# EasyEDA Pro project ProPrj_ABRGBDRV MK I_2025-07-25.epro

# Schematic Schematic1
Board Name: Board1; Create Date: 2025-07-16; Page Name: P1; Project Name: ABRGBDRV MK I; Schematic Name: Schematic1; Update Date: 2025-07-17; Company: 嘉立创EDA; Page Size: A4; Version: V1.0
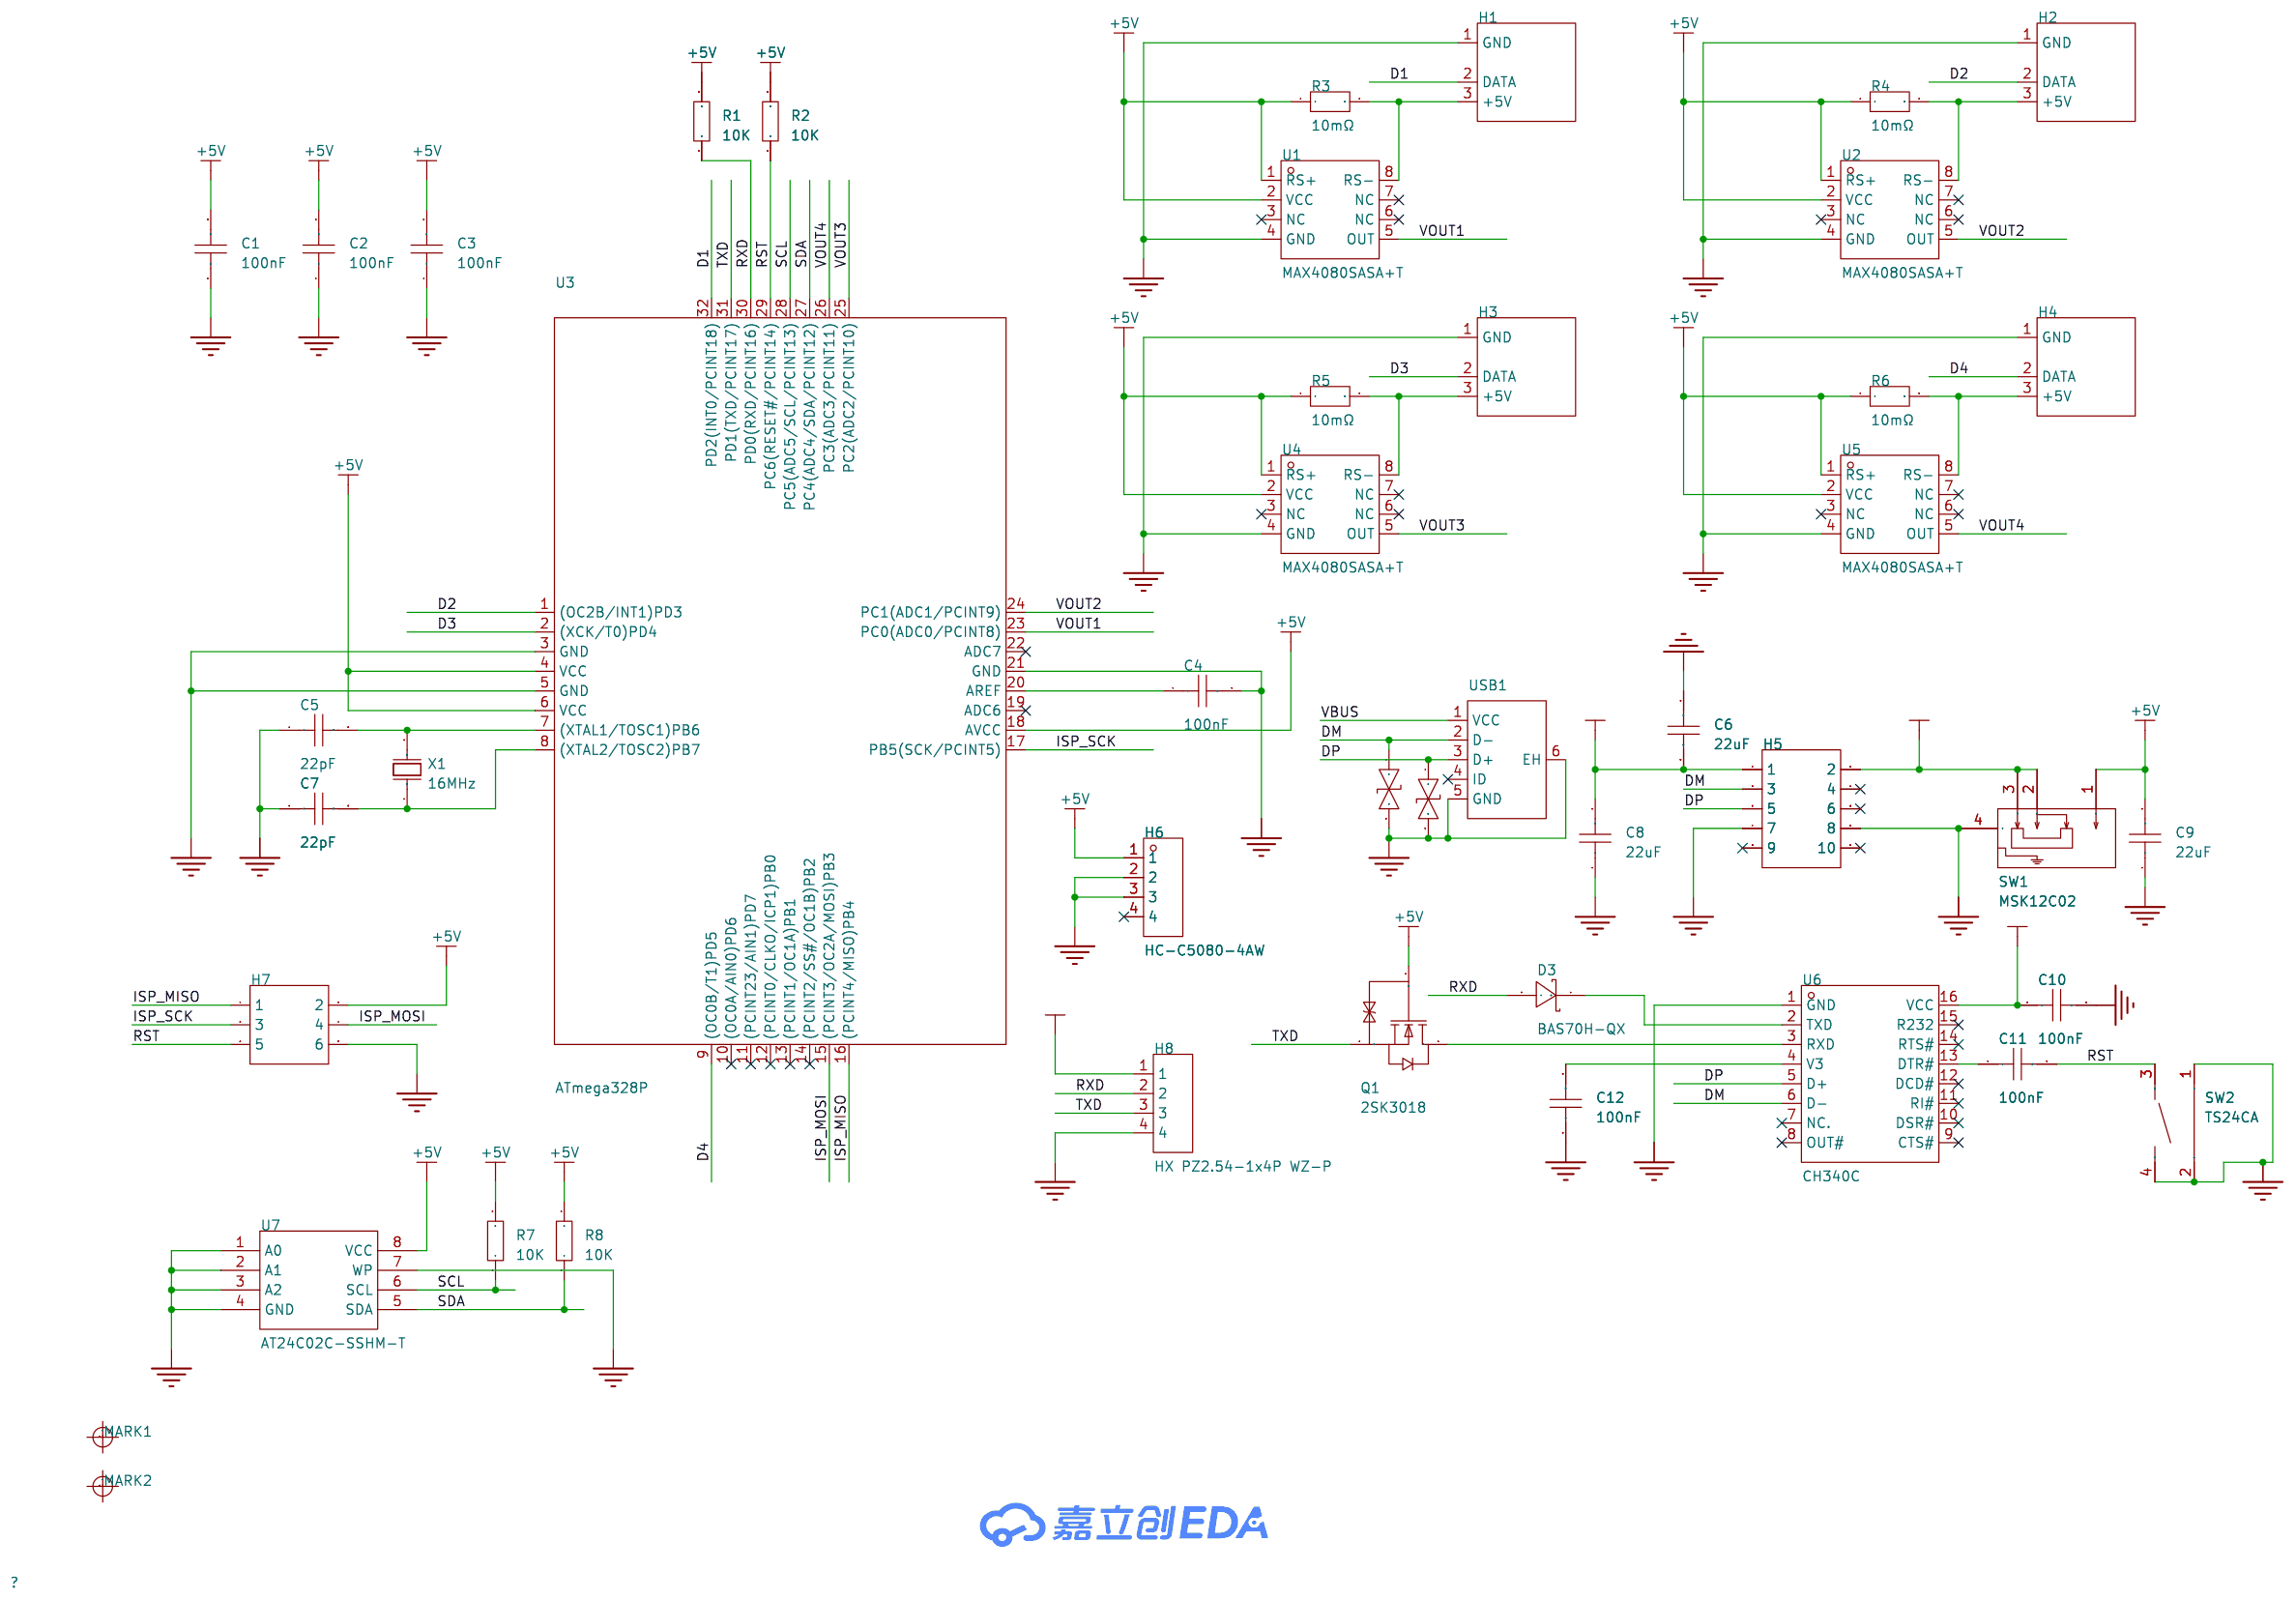
[diagram p0: schematic sheet]

## Parts
C1  100nF  [C0603]
C2  100nF  [C0603]
C3  100nF  [C0603]
C4  100nF  [C0603]
C5  22pF  [C0402]
C6  22uF  [C0805]
C7  22pF  [C0402]
C8  22uF  [C0805]
C9  22uF  [C0805]
C10  100nF  [C0603]
C11  100nF  [C0603]
C12  100nF  [C0603]
D1  0402ESDA-05N  [D0402]
D2  0402ESDA-05N  [D0402]
D3  BAS70H-QX  [SOD-123_L2.6-W1.6-LS3.5-RD]
H1  -  [ARGB TH_3P-P2.54 弯针]
H2  -  [ARGB TH_3P-P2.54 弯针]
H3  -  [ARGB TH_3P-P2.54 弯针]
H4  -  [ARGB TH_3P-P2.54 弯针]
H5  -  [HDR-TH_10P-P2.54-V-F-R2-C5-S2.54]
H6  HC-C5080-4AW  [CONN-TH_4P-P5.08_HCTL_HC-C5080-4AW]
H7  -  [HDR-TH_6P-P2.54-V-R2-C3-S2.54_A2541WV-2X3P]
H8  HX PZ2.54-1x4P WZ-P  [HDR-TH_4P-P2.54-H-M-W11.0]
MARK1  -  [Mark-Point-1mm]  (no BOM)
MARK2  -  [Mark-Point-1mm]  (no BOM)
Q1  2SK3018  [SOT-23-3_L2.9-W1.4-P1.90-LS2.6-BR]
R1  10K  [R0402]
R2  10K  [R0402]
R3  10mΩ  [R2512]
R4  10mΩ  [R2512]
R5  10mΩ  [R2512]
R6  10mΩ  [R2512]
R7  10K  [R0402]
R8  10K  [R0402]
SW1  MSK12C02  [SW-TH_MSK12C02]
SW2  TS24CA  [SW-SMD_TS24CA]
U1  MAX4080SASA+T  [SOP-8_L4.9-W3.9-P1.27-LS6.0-BL]
U2  MAX4080SASA+T  [SOP-8_L4.9-W3.9-P1.27-LS6.0-BL]
U3  ATmega328P  [LQFP-32_L7.0-W7.0-P0.80-LS9.0-TL]
U4  MAX4080SASA+T  [SOP-8_L4.9-W3.9-P1.27-LS6.0-BL]
U5  MAX4080SASA+T  [SOP-8_L4.9-W3.9-P1.27-LS6.0-BL]
U6  CH340C  [SOP-16_L10.0-W3.9-P1.27-LS6.0-BL]
U7  AT24C02C-SSHM-T  [SOIC-8_L5.0-W4.0-P1.27-LS6.0-BL]
USB1  -  [USB_Micro]
X1  16MHz  [CRYSTAL-TH_L11.1-W4.7-P4.88]

## Library data of the parts
C1-C4 C10-C12 = CAP_0603: Supplier Footprint: 0603
C5 C7 = CAP_0402: Supplier Footprint: 0402
C6 C8 C9 = CAP_0805: Supplier Footprint: 0805
D1 D2 = 0402ESDA-05N: 极性:双向;反向截止电压(Vrwm):5V;钳位电压:50V;; LCSC Part Name: 双向ESD; Supplier Part: C316049; Manufacturer: BORN(伯恩半导体); Supplier Footprint: 0402; JLCPCB Part Class: Extended Part; Datasheet: https://atta.szlcsc.com/upload/public/pdf/source/20181026/C316051_3197CA7AF3730883CA62970815D4F79F.pdf; Supplier: LCSC; Polarity: 双向; Reverse Stand-Off Voltage (Vrwm): 5V; Clamping Voltage: 50V; Type: ESD; Voltage - Reverse Standoff (Typ): 5V; Voltage - Clamping (Max) @ Ipp: 50V
D3 = BAS70H-QX: Supplier Part: C5311555; Manufacturer: Nexperia(安世); Supplier Footprint: SOD-123FL; JLCPCB Part Class: 扩展库; Datasheet: https://atta.szlcsc.com/upload/public/pdf/source/20240726/141E16AB3DB23AA7876C4F3DDFDC7B62.pdf; Supplier: LCSC
H1-H4 = ARGB 弯针: 插针结构:1x4P;间距:2.54mm;行距:-;圆针/方针:方针;安装方式:弯插;排数:单排;总PIN位数:4P;额定电流:3A;额定电压:-;配合针长度:6mm;塑高:2.5mm;端接针长度:3mm;触头材质:黄铜;触头镀层:金;工作温度:-40℃~+105℃;颜色:黑色;; Supplier Footprint: 弯插,P=2.54mm; JLCPCB Part Class: 扩展库; Datasheet: https://atta.szlcsc.com/upload/public/pdf/source/20240723/CEFBB84DDE30BB0D161FEC6DC376B233.pdf; Pin Structure: 1x4P; Pitch: 2.54mm; Circluar Pins/Square Pins: 方针; Mounting Type: 弯插; Number of Rows: 单排; Number of Pins: 4P; Current Rating: 3A; Length of Mating Pin: 6mm; Insulation Height: 2.5mm; Length of End Connection Pin: 3mm; Contact Material: 黄铜; Contact Plating: 金; Operating Temperature: -40℃~+105℃; Color: 黑色
H5 = HDR-F_2.54_2x5: Supplier Part: C92270; Supplier Footprint: 插件
H6 = HC-C5080-4AW: 插针结构:1x4P;间距:5.08mm;安装方式:弯插;参考系列:大4pin;总PIN数:4P;排数:1;每排PIN数:4;行距:-;额定电流:10A;触头材质:黄铜;触头镀层:锡;工作温度:-25℃~+85℃;; LCSC Part Name: 1x4P 间距:5.08mm 弯插 系列:大4pin; Supplier Part: C5221224; Manufacturer: HCTL(华灿天禄); Supplier Footprint: 弯插,P=5.08mm; JLCPCB Part Class: 扩展库; Datasheet: https://atta.szlcsc.com/upload/public/pdf/source/20241030/F3FABA2A64EED564336AF49B22573160.pdf; Supplier: LCSC; Pins Structure: 1x4P; Pitch: 5.08mm; Mounting Type: 弯插; Reference Series: 大4pin; Number of Pins: 4P; Number of Rows: 1; Number of PINs Per Row: 4; Current Rating: 10A; Contact Material: 黄铜; Contact Plating: 锡; Operating Temperature: -25℃~+85℃; Voltage Rating: 250V; Plastic Material: PA66; Flame Retardant Rating: UL94V-0; Supplementary Features: 带柱; Z-Height of the Board: 8.3mm; X-Length of Bottom Edge on Board (Spacing Line): 23.5mm; Y-Width of Bottom Edge on Board: 13.1mm
H7 = HDR-M_2.54_2x3: Supplier Part: C402781; Supplier Footprint: 插件,P=2.54mm
H8 = HX PZ2.54-1x4P WZ-P: 插针结构:1x4P;间距:2.54mm;行距:-;圆针/方针:方针;安装方式:弯插;排数:单排;总PIN位数:4P;额定电流:3A;额定电压:-;配合针长度:3mm;塑高:2.5mm;端接针长度:-;触头材质:黄铜;触头镀层:金;工作温度:-40℃~+105℃;颜色:黑色;; LCSC Part Name: 1x4P 间距:2.54mm 方针 弯插; Supplier Part: C42453953; Manufacturer: hanxia(韩下); Supplier Footprint: 弯插,P=2.54mm; Datasheet: https://atta.szlcsc.com/upload/public/pdf/source/20250120/1FC41925E8A06782788E8AF55E6E3E4A.pdf; Supplier: LCSC; Pin Structure: 1x4P; Pitch: 2.54mm; Circluar Pins/Square Pins: 方针; Mounting Type: 弯插; Number of Rows: 单排; Number of Pins: 4P; Current Rating: 3A; Length of Mating Pin: 3mm; Insulation Height: 2.5mm; Contact Material: 黄铜; Contact Plating: 金; Operating Temperature: -40℃~+105℃; Color: 黑色
MARK1 MARK2 = Mark-Point: Mark点
Q1 = 2SK3018: 类型:1个N沟道;漏源电压(Vdss):30V;连续漏极电流(Id):100mA;导通电阻(RDS(on)@Vgs,Id):13Ω@2.5V,1mA;功率:350mW;阈值电压(Vgs(th)@Id):800mV@100uA;; LCSC Part Name: 1个N沟道 耐压:30V 电流:100mA; Supplier Part: C727148; Manufacturer: TWGMC(台湾迪嘉); Supplier Footprint: SOT-23; JLCPCB Part Class: 扩展库; Datasheet: https://atta.szlcsc.com/upload/public/pdf/source/20200827/C727148_2301BBDB89FCE642A4A39ABEF7075607.pdf; Supplier: LCSC; Type: 1个N沟道; Drain Source Voltage (Vdss): 30V; Continuous Drain Current (Id): 100mA; Drain Source On Resistance (RDS(on)@Vgs,Id): 13Ω@2.5V,1mA; Power Dissipation (Pd): 350mW; Gate Threshold Voltage (Vgs(th)@Id): 800mV@100uA; Input Capacitance (Ciss@Vds): 13pF; Reverse Transfer Capacitance (Crss@Vds): 4pF; Operating Temperature: -55℃~+150℃
R1 R2 R7 R8 = Res_0402: Supplier Footprint: 0402
R3-R6 = RE2512F3R010: 电阻类型:采样电阻;阻值:10mΩ;精度:±1%;功率:3W;温度系数:±50ppm/℃;; LCSC Part Name: 10mΩ 3W 2512 ±1%; Supplier Part: C46961753; Manufacturer: 捷而瑞; Supplier Footprint: 2512; JLCPCB Part Class: 扩展库; Datasheet: https://atta.szlcsc.com/upload/public/pdf/source/20250325/401775B85EF7B3A580BC34DFED100CB2.pdf; Supplier: LCSC; Type: 采样电阻; Tolerance: ±1%; Power(Watts): 3W; Temperature Coefficient: ±50ppm/℃
SW1 = MSK12C02: 电路结构:单刀双掷;安装方式:卧贴;开关颜色:-;额定电流(DC):50mA;额定电压(DC):12V;额定电流(AC):-;额定电压(AC):-;机械寿命:1万次;; LCSC Part Name: 两档侧拨贴片 7脚 滑动开关; Supplier Part: C431540; Manufacturer: SHOU HAN(首韩); Supplier Footprint: SMD; JLCPCB Part Class: 扩展库; Datasheet: https://atta.szlcsc.com/upload/public/pdf/source/20190925/C431540_89155AEF0758B9AD1B2D805F83FB12E3.pdf; Supplier: LCSC; Circuit: 单刀双掷; Pin Style: SMD接片; Switch Length: 8mm; Switch Width: 2.8mm; Switch Height: 1.4mm; Mounting Style: 卧贴; Current Rating (DC): 50mA; Voltage Rating (DC): 12V; Mechanical Life: 1万次; Operating Temperature: -20℃~+70℃
SW2 = TS24CA: 电路结构:单刀单掷;按钮形状:矩形按钮;安装方式:卧贴;开关长度:4.55mm;开关宽度:1.8mm;开关高度:3.5mm;触点电流:50mA;额定电压:12V;带灯:-;工作寿命:-;; LCSC Part Name: 4.55*1.8*3.5mm 卧贴 轻触开关; Supplier Part: C393942; Manufacturer: SHOU HAN(首韩); Supplier Footprint: SMD; JLCPCB Part Class: 扩展库; Datasheet: https://atta.szlcsc.com/upload/public/pdf/source/20240424/43D93777DD1504A9F6E2A772ABCDC7B4.pdf; Supplier: LCSC; Circuit: 单刀单掷; Actuator Style: 矩形按钮; Mounting Type: 卧贴; Length: 4.55mm; Width: 1.8mm; Switch Height: 3.5mm; Contact Current: 50mA; Voltage Rating: 12V
U1 U2 U4 U5 = MAX4080SASA+T: 放大器数:单路;共模电压:4.5V~76V;增益:60V/V;带宽:250kHz;; LCSC Part Name: 76V高压侧电流检测放大器; Supplier Part: C89039; Manufacturer: ADI(亚德诺)/MAXIM(美信); Supplier Footprint: SOP-8; JLCPCB Part Class: 扩展库; Datasheet: https://atta.szlcsc.com/upload/public/pdf/source/20190813/C89039_F3362700B6EEE741CB68F7E6A4431CFD.pdf; Supplier: LCSC; Number of Channels: 单路; Vcm - Common Mode Voltage: 4.5V~76V; Gain: 60V/V; Bandwidth: 250kHz; Voltage - Supply: 4.5V~76V; Operating Temperature: -40℃~+125℃
U3 = ATmega328P: Supplier Part: C9900009806; Supplier Footprint: LQFP-32(7x7); JLCPCB Part Class: 扩展库; Supplier: LCSC
U6 = CH340C: 应用功能:收发器;接口协议:USB 2.0;数据速率:2Mbps;; Supplier Part: C84681; Manufacturer: WCH(南京沁恒); Supplier Footprint: SOP-16; JLCPCB Part Class: 扩展库; Datasheet: https://atta.szlcsc.com/upload/public/pdf/source/20240619/63986D8440D4E5267A77ACD891CC4DE3.pdf; Supplier: LCSC; Applications Function: 收发器; Protocol: USB 2.0; Voltage - Supply: 3.3V；5V; Data Rate: 2Mbps
U7 = AT24C02C-SSHM-T: 接口类型:I2C;存储容量:2Kbit;; Supplier Part: C6203; Manufacturer: MICROCHIP(美国微芯); Supplier Footprint: SOIC-8; JLCPCB Part Class: 扩展库; Datasheet: https://atta.szlcsc.com/upload/public/pdf/source/20150601/1457707316447.pdf; Supplier: LCSC; Interface Type: I2C; Memory Size: 2Kbit; Supply Voltage: 1.7V~5.5V; Operating Temperature: -40℃~+85℃
USB1 = USB_Micro-B: Supplier Footprint: SMD
X1 = SCBYS16X00000ELRJ: 晶振类型:-;频率:16MHz;常温频差:±20ppm;负载电容:20pF;频率稳定度:±30ppm;; LCSC Part Name: 16M 20PF 20PPM 6.0mm; Supplier Part: C48384658; Manufacturer: SST(索斯特); Supplier Footprint: HC-49S; JLCPCB Part Class: 扩展库; Datasheet: https://atta.szlcsc.com/upload/public/pdf/source/20250418/E6A55690AE536C1474510BF0C8D4E3CC.pdf; Supplier: LCSC; Normal temperature Frequency Tolerance: ±20ppm; Load Capacitance: 20pF; Frequency Stability: ±30ppm; Equivalent Series Resistance(ESR): 30Ω; Operating Temperature: -40℃~+85℃

## Nets
+5V: C1.2 C2.2 C3.2 C9.2 H6.1 H7.2 Q1.1(G) R1.2 R2.2 R3.1 R4.1 R5.1 R6.1 R7.2 R8.2 SW1.1 U1.1(RS+) U1.2(VCC) U2.1(RS+) U2.2(VCC) U3.4(VCC) U3.6(VCC) U3.18(AVCC) U4.1(RS+) U4.2(VCC) U5.1(RS+) U5.2(VCC) U7.8(VCC)
GND: C1.1 C2.1 C3.1 C4.2 C5.1 C6.1 C7.1 C8.1 C9.1 C10.2 C12.1 D1.2 D2.2 H1.1(GND) H2.1(GND) H3.1(GND) H4.1(GND) H5.7 H5.8 H6.2 H6.3 H7.6 H8.4 SW1.4 SW2.1 SW2.2 SW2.4 U1.4(GND) U2.4(GND) U3.3(GND) U3.5(GND) U3.21(GND) U4.4(GND) U5.4(GND) U6.1(GND) U7.1(A0) U7.2(A1) U7.3(A2) U7.4(GND) U7.7(WP) USB1.5(GND) USB1.6(EH)
VBUS: C6.2 C8.2 C10.1 H5.1 H5.2 H8.1 SW1.2 SW1.3 U6.16(VCC) USB1.1(VCC)
D1: H1.2(DATA) U3.32(PD2(INT0/PCINT18))
D2: H2.2(DATA) U3.1((OC2B/INT1)PD3)
D3: H3.2(DATA) U3.2((XCK/T0)PD4)
D4: H4.2(DATA) U3.9((OC0B/T1)PD5)
DM: D1.1 H5.3 U6.6(D-) USB1.2(D-)
DP: D2.1 H5.5 U6.5(D+) USB1.3(D+)
ISP_MISO: H7.1 U3.16((PCINT4/MISO)PB4)
ISP_MOSI: H7.4 U3.15((PCINT3/OC2A/MOSI)PB3)
ISP_SCK: H7.3 U3.17(PB5(SCK/PCINT5))
RST: C11.2 H7.5 R2.1 SW2.3 U3.29(PC6(RESET#/PCINT14))
RXD: D3.2(A) H8.2 R1.1 U3.30(PD0(RXD/PCINT16))
SCL: R7.1 U3.28(PC5(ADC5/SCL/PCINT13)) U7.6(SCL)
SDA: R8.1 U3.27(PC4(ADC4/SDA/PCINT12)) U7.5(SDA)
TXD: H8.3 Q1.2(S) U3.31(PD1(TXD/PCINT17))
VOUT1: U1.5(OUT) U3.23(PC0(ADC0/PCINT8))
VOUT2: U2.5(OUT) U3.24(PC1(ADC1/PCINT9))
VOUT3: U3.25(PC2(ADC2/PCINT10)) U4.5(OUT)
VOUT4: U3.26(PC3(ADC3/PCINT11)) U5.5(OUT)
$1N497: C5.2 U3.7((XTAL1/TOSC1)PB6) X1.2(OSC2)
$1N523: C7.2 U3.8((XTAL2/TOSC2)PB7) X1.1(OSC1)
$1N1166: H1.3(+5V) R3.2 U1.8(RS-)
$1N2775: C12.2 U6.4(V3)
$1N3268: Q1.3(D) U6.3(RXD)
$1N3304: D3.1(C) U6.2(TXD)
$1N3412: C11.1 U6.13(DTR#)
$1N3449: C4.1 U3.20(AREF)
$1N3635: H2.3(+5V) R4.2 U2.8(RS-)
$1N3989: H4.3(+5V) R6.2 U5.8(RS-)
$1N3996: H3.3(+5V) R5.2 U4.8(RS-)

Not connected (* = marked no-connect by the designer): H5 4* 6* 9* 10*; H6 4*; MARK1 1; MARK2 1; U1 3(NC)* 6(NC)* 7(NC)*; U2 3(NC)* 6(NC)* 7(NC)*; U3 10((OC0A/AIN0)PD6)* 11((PCINT23/AIN1)PD7)* 12((PCINT0/CLKO/ICP1)PB0)* 13((PCINT1/OC1A)PB1)* 14((PCINT2/SS#/OC1B)PB2)* 19(ADC6)* 22(ADC7)*; U4 3(NC)* 6(NC)* 7(NC)*; U5 3(NC)* 6(NC)* 7(NC)*; U6 7(NC.)* 8(OUT#)* 9(CTS#)* 10(DSR#)* 11(RI#)* 12(DCD#)* 14(RTS#)* 15(R232)*; USB1 4(ID)*

# Board PCB1
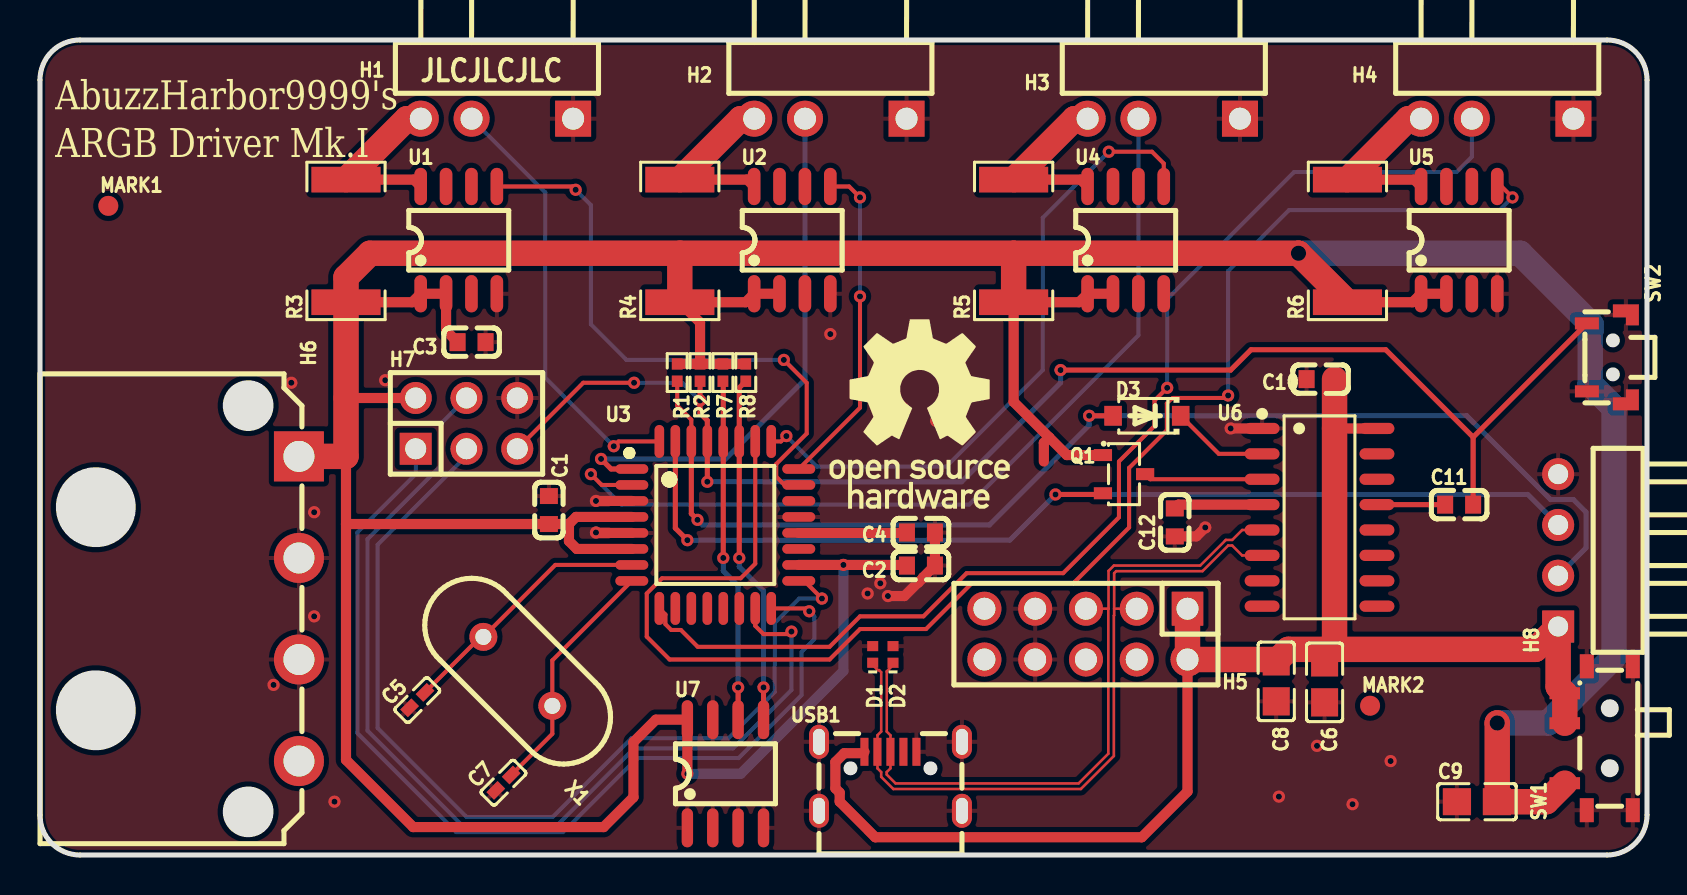
[diagram p1: board, top side]
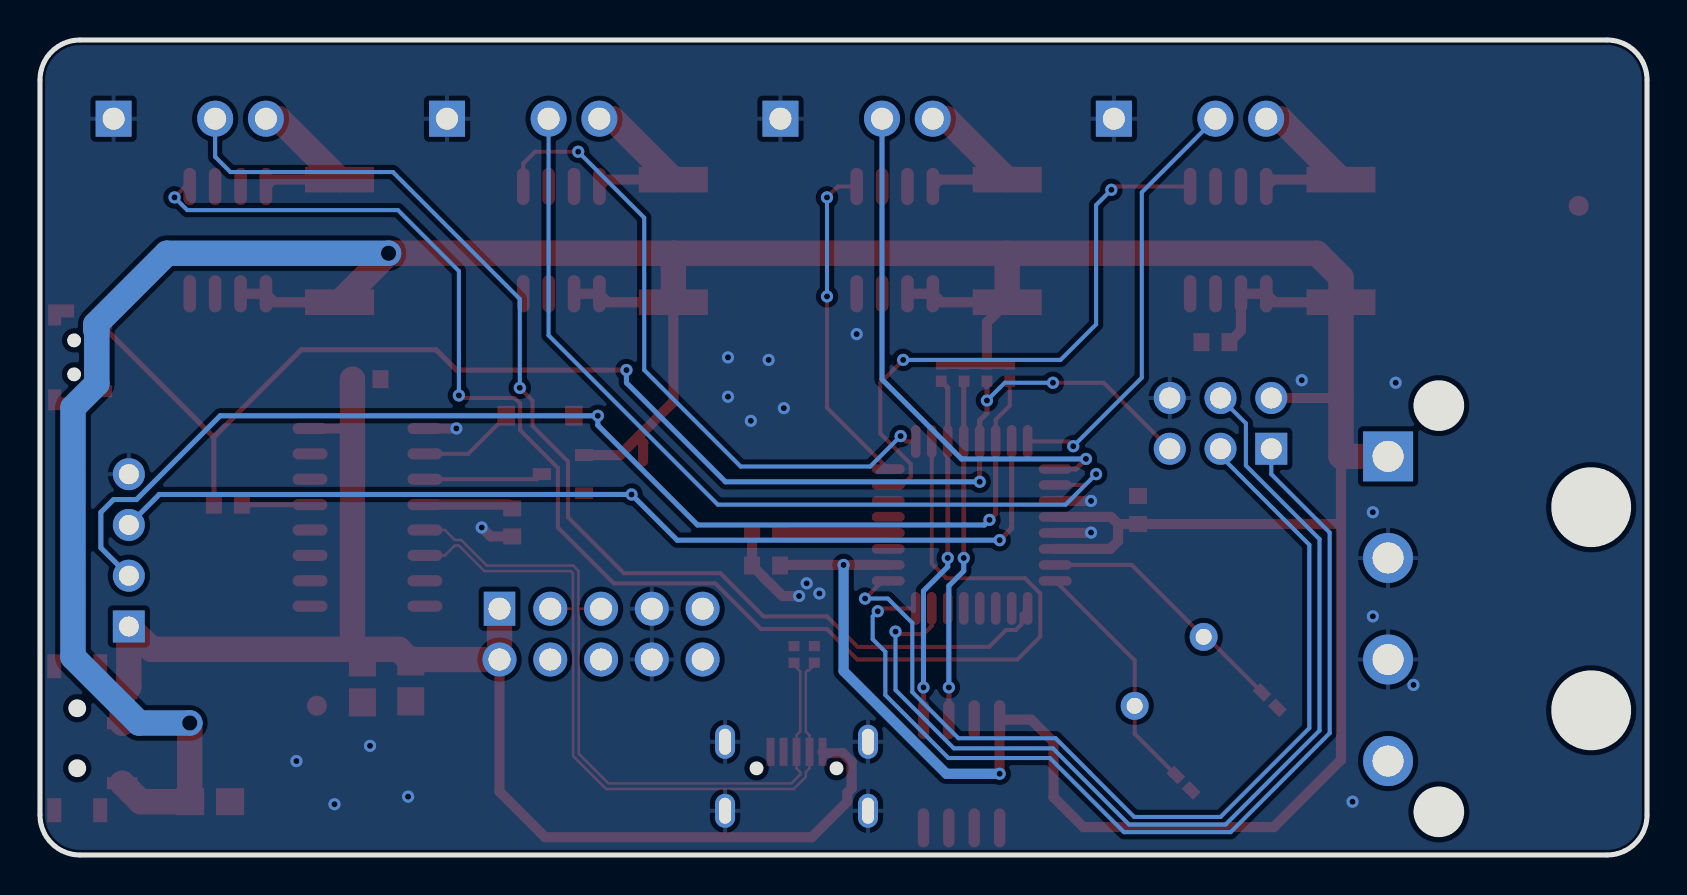
[diagram p2: board, bottom side, seen from below]

Outline 80.39 x 40.77 mm; copper layers: Top Layer, Bottom Layer. Coordinates in mm from the lower left corner of the outline.
Outline path: 0,38.77 0,2 arc(0.59,0.59) 2,0 78.39,0 arc(79.81,0.59) 80.39,2 80.39,38.77 arc(79.81,40.18) 78.39,40.77 2,40.77 arc(0.59,40.18) 0,38.77
Stack: Top Layer 0.035mm / Dielectric1 1.51mm FR4 er 4.5 / Bottom Layer 0.035mm

## Design rules (mm)
net DP: DP1
net DM: DP1
template: 自定义配置
spacing copperThickness1oz (default): track to track 0.102, other pairs 0.152 to 0.3
spacing copperThickness2oz: track to track 0.203, other pairs 0.152 to 0.3
track width copperThickness1oz (default): min 0.127, default 0.254, max 2.54
track width copperThickness2oz: min 0.203, default 0.254, max 2.54
differential pair differentialPair (default): width min 0.127, default 0.254, max 2.54; gap min 0.152, default 0.152
via viaSize (default): diameter min 0.5, default 0.61, max 10; hole min 0.3, default 0.305, max 6.3

## Placement (name value [footprint] x y rotation side)
C1  100nF  [C0603]  25.46 17.25 270 top
C2  100nF  [C0603]  44.07 14.48 180 top
C3  100nF  [C0603]  21.59 25.65 180 top
C4  100nF  [C0603]  44.07 16.13 0 top
C5  22pF  [C0402]  18.88 7.75 45 top
C6  22uF  [C0805]  64.26 8.64 90 top
C7  22pF  [C0402]  23.19 3.62 45 top
C8  22uF  [C0805]  61.84 8.69 90 top
C9  22uF  [C0805]  71.88 2.67 0 top
C10  100nF  [C0603]  64.06 23.8 180 top
C11  100nF  [C0603]  70.99 17.53 0 top
C12  100nF  [C0603]  56.77 16.64 90 top
D1  0402ESDA-05N  [D0402]  41.66 10.03 90 top
D2  0402ESDA-05N  [D0402]  42.67 10.03 90 top
D3  BAS70H-QX  [SOD-123_L2.6-W1.6-LS3.5-RD]  55.37 21.97 180 top
H1  -  [ARGB TH_3P-P2.54 弯针]  22.86 36.83 0 top
H2  -  [ARGB TH_3P-P2.54 弯针]  39.54 36.83 0 top
H3  -  [ARGB TH_3P-P2.54 弯针]  56.22 36.83 0 top
H4  -  [ARGB TH_3P-P2.54 弯针]  72.9 36.83 0 top
H5  -  [HDR-TH_10P-P2.54-V-F-R2-C5-S2.54]  52.32 11.05 180 top
H6  HC-C5080-4AW  [CONN-TH_4P-P5.08_HCTL_HC-C5080-4AW]  12.95 12.32 270 top
H7  -  [HDR-TH_6P-P2.54-V-R2-C3-S2.54_A2541WV-2X3P]  21.34 21.59 0 top
H8  HX PZ2.54-1x4P WZ-P  [HDR-TH_4P-P2.54-H-M-W11.0]  75.95 15.24 90 top
MARK1  -  [Mark-Point-1mm]  3.42 32.47 0 top
MARK2  -  [Mark-Point-1mm]  66.54 7.47 0 top
Q1  2SK3018  [SOT-23-3_L2.9-W1.4-P1.90-LS2.6-BR]  54.23 19.05 180 top
R1  10K  [R0402]  31.88 24.13 90 top
R2  10K  [R0402]  33.02 24.13 90 top
R3  10mΩ  [R2512]  15.31 30.72 90 top
R4  10mΩ  [R2512]  32.01 30.72 90 top
R5  10mΩ  [R2512]  48.71 30.72 90 top
R6  10mΩ  [R2512]  65.41 30.72 90 top
R7  10K  [R0402]  34.16 24.13 90 top
R8  10K  [R0402]  35.31 24.13 90 top
SW1  MSK12C02  [SW-TH_MSK12C02]  77.98 5.84 90 top
SW2  TS24CA  [SW-SMD_TS24CA]  78.36 24.89 270 top
U1  MAX4080SASA+T  [SOP-8_L4.9-W3.9-P1.27-LS6.0-BL]  20.95 30.76 0 top
U2  MAX4080SASA+T  [SOP-8_L4.9-W3.9-P1.27-LS6.0-BL]  37.63 30.76 0 top
U3  ATmega328P  [LQFP-32_L7.0-W7.0-P0.80-LS9.0-TL]  33.78 16.51 0 top
U4  MAX4080SASA+T  [SOP-8_L4.9-W3.9-P1.27-LS6.0-BL]  54.31 30.76 0 top
U5  MAX4080SASA+T  [SOP-8_L4.9-W3.9-P1.27-LS6.0-BL]  70.99 30.76 0 top
U6  CH340C  [SOP-16_L10.0-W3.9-P1.27-LS6.0-BL]  64.01 16.89 270 top
U7  AT24C02C-SSHM-T  [SOIC-8_L5.0-W4.0-P1.27-LS6.0-BL]  34.29 4.06 0 top
USB1  -  [USB_Micro]  42.54 3.94 0 top
X1  16MHz  [CRYSTAL-TH_L11.1-W4.7-P4.88]  23.9 9.19 135 top

## Footprints (pads in the part's own frame, mm; a bottom-side part is the same pattern mirrored in y, then rotated)
ARGB TH_3P-P2.54 弯针
  rect 1.8x1.8 hole 1.1: 1(3.81,0)
  round 1.8 hole 1.1: 2(-1.27,0) 3(-3.81,0)
C0402
  rect 0.79x0.54 smd: 1(-0.545,0) 2(0.545,0)
C0603
  rect 0.8x0.9 smd: 1(-0.7,0) 2(0.7,0)
C0805
  rect 1.41x1.35 smd: 1(-1,0) 2(1,0)
CONN-TH_4P-P5.08_HCTL_HC-C5080-4AW
  rect 2.5x2.5 hole 1.55: 1(-7.62,0)
  round 2.5 hole 1.55: 2(-2.54,0) 3(2.54,0) 4(7.62,0)
CRYSTAL-TH_L11.1-W4.7-P4.88
  round 1.4 hole 0.8: 1(-2.44,0) 2(2.44,0)
D0402
  rect 0.505x0.551 smd: 1(-0.416,0) 2(0.416,0)
HDR-TH_4P-P2.54-H-M-W11.0
  rect 1.6x1.6 hole 1: 1(-3.81,0)
  round 1.6 hole 1: 2(-1.27,0) 3(1.27,0) 4(3.81,0)
HDR-TH_6P-P2.54-V-R2-C3-S2.54_A2541WV-2X3P
  rect 1.6x1.6 hole 1.05: 1(-2.54,-1.27)
  round 1.6 hole 1.05: 2(-2.54,1.27) 3(0,-1.27) 4(0,1.27) 5(2.54,-1.27) 6(2.54,1.27)
HDR-TH_10P-P2.54-V-F-R2-C5-S2.54
  rect 1.575x1.7 hole 1.1: 1(-5.08,-1.27)
  round 1.7 hole 1.1: 2(-5.08,1.27) 3(-2.54,-1.27) 4(-2.54,1.27) 5(0,-1.27) 6(0,1.27) 7(2.54,-1.27) 8(2.54,1.27) 9(5.08,-1.27) 10(5.08,1.27)
LQFP-32_L7.0-W7.0-P0.80-LS9.0-TL
  oval 1.65x0.48 smd: 1(-4.176,2.799) 2(-4.176,2) 3(-4.176,1.2) 4(-4.176,0.4) 5(-4.176,-0.4) 6(-4.176,-1.2) 7(-4.176,-2) 8(-4.176,-2.799) 17(4.176,-2.799) 18(4.176,-2) 19(4.176,-1.2) 20(4.176,-0.4) 21(4.176,0.4) 22(4.176,1.2) 23(4.176,2) 24(4.176,2.799)
  oval 0.48x1.65 smd: 9(-2.799,-4.176) 10(-2,-4.176) 11(-1.2,-4.176) 12(-0.4,-4.176) 13(0.4,-4.176) 14(1.2,-4.176) 15(2,-4.176) 16(2.799,-4.176) 25(2.799,4.176) 26(1.999,4.176) 27(1.199,4.176) 28(0.399,4.176) 29(-0.399,4.176) 30(-1.199,4.176) 31(-1.999,4.176) 32(-2.799,4.176)
Mark-Point-1mm
  round 1 smd: 1(0,0)
R0402
  rect 0.566x0.54 smd: 1(-0.433,0) 2(0.433,0)
R2512
  rect 1.282x3.456 smd: 1(-3.067,0) 2(3.067,0)
SOD-123_L2.6-W1.6-LS3.5-RD
  rect 0.88x0.99 smd: 1(-1.692,0) 2(1.692,0)
SOIC-8_L5.0-W4.0-P1.27-LS6.0-BL
  oval 0.569x1.95 smd: 1(-1.905,-2.705) 2(-0.635,-2.705) 3(0.635,-2.705) 4(1.905,-2.705) 5(1.905,2.705) 6(0.635,2.705) 7(-0.635,2.705) 8(-1.905,2.705)
SOP-8_L4.9-W3.9-P1.27-LS6.0-BL
  oval 0.63x1.865 smd: 1(-1.905,-2.683) 2(-0.635,-2.683) 3(0.635,-2.683) 4(1.905,-2.683) 5(1.905,2.683) 6(0.635,2.683) 7(-0.635,2.683) 8(-1.905,2.683)
SOP-16_L10.0-W3.9-P1.27-LS6.0-BL
  oval 0.56x1.745 smd: 1(-4.445,-2.873) 2(-3.175,-2.873) 3(-1.905,-2.873) 4(-0.635,-2.873) 5(0.635,-2.873) 6(1.905,-2.873) 7(3.175,-2.873) 8(4.445,-2.873) 9(4.445,2.873) 10(3.175,2.873) 11(1.905,2.873) 12(0.635,2.873) 13(-0.635,2.873) 14(-1.905,2.873) 15(-3.175,2.873) 16(-4.445,2.873)
SOT-23-3_L2.9-W1.4-P1.90-LS2.6-BR
  rect 0.91x0.6 smd: 1(1.055,-0.955) 2(1.055,0.955) 3(-1.055,0)
SW-SMD_TS24CA
  custom 1.05x1.3 smd: 1(-2.125,0.975) 2(2.125,0.975)
  rect 0.6x1.2 smd: 3(-1.7,-0.975) 4(1.7,-0.975)
SW-TH_MSK12C02
  rect 0.6x1.524 smd: 1(-2.25,1.7) 2(0.75,1.7) 3(2.25,1.7)
  rect 1.2x0.7 smd: 4(-3.6,0.6) 4(-3.6,-1.7) 4(3.6,0.6) 4(3.6,-1.7)
USB_Micro
  rect 0.4x1.4 smd: 1(-1.3,1.225) 2(-0.65,1.225) 3(0,1.225) 4(0.65,1.225) 5(1.3,1.225)
  oval 1x1.7 hole 0.6x1.3: 6(-3.575,1.725) 6(-3.575,-1.725) 6(3.575,1.725) 6(3.575,-1.725)

## Nets
As in the schematic.

Pads without a net: H5 4 6 9 10; H6 4; MARK1 1; MARK2 1; U1 3 6 7; U2 3 6 7; U3 10 11 12 13 14 19 22; U4 3 6 7; U5 3 6 7; U6 7 8 9 10 11 12 14 15; USB1 4

## Via types
v1: diameter 1.27, hole 0.762, Top Layer to Bottom Layer, 2 vias
v2: diameter 0.61, hole 0.305, Top Layer to Bottom Layer, 52 vias

## Routing (per net, layer and track width the routed paths; a pad name or vN(x,y) marks a point on that pad's centre or on a via; arc(x,y) is an arc through that point)
+5V: length 241.1
  Top Layer w0.508: 50.49,20.89 51.37,20 Q1.1 ; 50.49,20.89 50.22,20.62 50.22,19.69 ; 50.49,20.89 48.71,22.67 R5.1 51.98,27.65 U4.1 U4.2 ; v2(32.38,4.06) U7.8 30.81,6.77 29.69,5.65 29.69,2.89 28.19,1.4 18.67,1.4 15.31,4.76 15.31,16.55 ; H7.2 15.31,22.86 ; R2.2 R7.2 R8.2 ; R2.2 33.02,26.64 R4.1 35.3,27.65 U2.1 U2.2 ; R2.2 R1.2 ; 26.46,16.55 26.82,16.91 U3.4 ; 26.46,16.55 C1.2 15.31,16.55 ; 26.46,16.55 26.46,15.7 26.85,15.31 U3.6 ; 15.31,16.55 15.31,19.94 ; C3.2 20.31,26.23 U1.2 U1.1 18.62,27.65 R3.1 ; U5.2 U5.1 68.66,27.65 R6.1 ; C2.2 43.34,14.51 v2(40.19,14.51) U3.18
  Top Layer w1.27: 32.01,30.1 R4.1 ; 32.01,30.1 16.51,30.1 15.31,28.9 R3.1 15.31,19.94 H6.1 ; 32.01,30.1 48.71,30.1 ; v1(72.9,6.6) 72.9,2.68 C9.2 75.35,2.67 SW1.1 ; 48.71,30.1 R5.1 ; 48.71,30.1 v1(62.96,30.1) R6.1
  Bottom Layer w0.508: v2(40.19,14.51) 40.19,9.2 35.05,4.06 v2(32.38,4.06)
  Bottom Layer w1.27: v1(72.9,6.6) 75.44,6.6 78.74,9.91 78.74,22.38 77.55,23.57 77.55,26.21 77.6,26.26 77.6,26.54 74.04,30.1 v1(62.96,30.1)
GND: length 11.5
  Top Layer w0.508: v2(42.42,12.95) 43.25,12.95 43.91,13.62 43.94,13.62 44.18,13.86 44.18,13.88 C2.1 C4.2 ; C12.1 57.85,15.94 v2(58.29,16.38) ; U3.5 27.83,16.11 v2(27.81,16.13) ; 61.14,21.34 v2(59.56,21.34) ; U3.3 v2(27.81,17.71)
  vias: v2(11.68,8.51) v2(12.57,23.62) v2(13.72,17.14) v2(13.72,11.94) v2(14.73,2.67) v2(17.27,23.75) v2(39.54,26.06) v2(41.4,13.08) v2(42.04,13.59) v2(43.18,22.35) v2(43.94,24.77) v2(44.83,21.72) v2(45.97,24.89) v2(45.97,22.92) v2(61.98,2.92) v2(63.88,5.46) v2(65.66,2.54) v2(67.56,4.7)
VBUS: length 71.9
  Top Layer w0.508: 41.25,5.16 41.18,5.09 40.23,5.09 39.79,4.65 39.79,3.34 40,3.12 40,2.67 41.78,0.89 55.12,0.89 57.4,3.17 H5.2 ; 66.88,21.34 64.76,21.34
  Top Layer w1.27: C10.1 64.76,10.29 ; 64.76,10.29 74.8,10.29 H8.1 75.95,8.42 SW1.3 SW1.2 ; 64.76,10.29 62.44,10.29 C8.2 61.75,9.78 H5.2 H5.1
D1: length 21.7
  Top Layer w0.203: U3.32 28.94,20.69 v2(28.7,20.45)
  Bottom Layer w0.203: v2(28.7,20.45) 25.27,23.88 25.27,33.15 H1.2
D2: length 26.6
  Top Layer w0.254: U3.1 28.57,19.31 v2(28.07,19.81)
  Bottom Layer w0.254: H2.2 38.27,23.79 34.29,19.81 v2(28.07,19.81)
D3: length 44.6
  Top Layer w0.203: U3.2 28.1,18.51 v2(27.56,19.05)
  Bottom Layer w0.203: H3.2 54.95,25.99 46.48,17.53 29.08,17.53 v2(27.56,19.05)
D4: length 58.8
  Top Layer w0.203: v2(56.39,23.37) 55.75,22.73 55.75,21.46 53.97,19.69 53.97,16.89 51.18,14.1 46.35,14.1 44.2,11.94 41.02,11.94 39.5,10.41 32.9,10.41 32.06,11.26 31.58,11.26 31.29,11.55 31.29,12.03 U3.9
  Bottom Layer w0.203: v2(56.39,23.37) 56.39,27.81 62.74,34.16 70.87,34.16 71.63,34.92 H4.2
DM: length 37.1
  Top Layer w0.127: 53.73,12.32 53.73,14.1 53.84,14.2 58.15,14.2 59.44,15.48 59.64,15.48 60.14,14.99 U6.6 ; 53.73,12.32 H5.3 ; 53.73,12.32 53.73,11.99 53.72,11.97 53.72,4.95 52.07,3.3 42.69,3.3 42.08,3.91 42.08,4.15 41.9,4.33 41.9,5.99 42.08,6.17 42.08,9.14 41.98,9.25 41.91,9.25 41.66,9.5 D1.1
DP: length 36.6
  Top Layer w0.127: D2.1 42.67,9.5 42.36,9.19 42.36,6.17 42.54,5.99 42.54,4.33 42.36,4.15 42.36,4.02 42.8,3.58 51.95,3.58 53.44,5.07 53.44,12.32 ; U6.5 60.14,16.26 59.64,15.76 59.32,15.76 58.04,14.48 53.72,14.48 53.45,14.21 53.45,12.32 53.44,12.32 ; 53.44,12.32 H5.5
ISP_MISO: length 49.1
  Top Layer w0.203: v2(38.48,12.19) 38.34,12.33 36.58,12.33
  Bottom Layer w0.203: v2(38.48,12.19) 38.74,11.94 38.74,10.8 38.1,10.16 38.1,8 34.95,4.85 29.87,4.85 26.16,1.14 20.83,1.14 15.88,6.1 15.88,16.13 18.8,19.05 18.8,20.32
ISP_MOSI: length 50.5
  Top Layer w0.203: v2(37.59,11.18) 37.47,11.05 36.19,11.05 35.78,11.46 U3.15
  Bottom Layer w0.203: v2(37.59,11.18) 37.59,8.25 34.67,5.33 29.72,5.33 25.91,1.52 21.08,1.52 16.38,6.22 16.38,15.8 20.07,19.48 20.07,21.59 H7.4
ISP_SCK: length 48
  Top Layer w0.203: U3.17 38.23,13.71 v2(39.12,12.83)
  Bottom Layer w0.203: 21.34,20.32 21.34,19.97 16.89,15.52 16.89,6.35 21.34,1.91 25.65,1.91 29.59,5.84 34.44,5.84 36.75,8.15 36.75,11.61 37.97,12.83 v2(39.12,12.83)
RST: length 70.7
  Top Layer w0.203: 23.88,20.32 27.18,23.62 v2(29.72,23.62)
  Top Layer w0.254: 71.69,20.9 67.32,25.27 60.58,25.27 59.56,24.26 v2(51.05,24.26) ; 71.69,20.9 C11.2 ; 71.69,20.9 SW2.3 ; R2.1 v2(33.02,22.73) 33.02,22.1 33.38,21.73 U3.29 v2(33.38,18.67)
  Bottom Layer w0.203: v2(33.02,22.73) 32.13,23.62 v2(29.72,23.62)
  Bottom Layer w0.254: v2(51.05,24.26) 51.05,23.62 46.1,18.67 v2(33.38,18.67)
RXD: length 61.4
  Top Layer w0.203: R1.1 31.88,22.48 32.58,21.77 U3.30
  Top Layer w0.254: v2(52.49,21.97) D3.2 ; U3.30 32.58,17.07 v2(32.89,16.76)
  Bottom Layer w0.254: v2(32.89,16.76) 33.15,16.51 47.5,16.51 52.49,21.5 v2(52.49,21.97) 71.37,21.97 75.56,17.78 76.71,17.78 77.34,17.14 77.34,15.37 H8.2
SCL: length 17.2
  Top Layer w0.254: U7.6 v2(34.93,8.38) ; R7.1 34.18,23.68 U3.28 v2(34.18,14.86)
  Bottom Layer w0.254: v2(34.18,14.86) 34.18,14.21 34.93,13.46 v2(34.93,8.38)
SDA: length 17.6
  Top Layer w0.254: R8.1 34.98,23.37 v2(34.98,14.86) ; v2(36.19,8.38) U7.5
  Bottom Layer w0.254: v2(36.19,8.38) 36.19,13.21 34.98,14.42 v2(34.98,14.86)
TXD: length 52.7
  Top Layer w0.254: U3.31 31.78,16.35 v2(32.38,15.75) ; Q1.2 53.11,18.03 v2(50.8,18.03)
  Bottom Layer w0.254: v2(32.38,15.75) 48.51,15.75 v2(50.8,18.03) 74.42,18.03 75.95,16.51
VOUT1: length 29.7
  Top Layer w0.203: v2(37.21,24.77) 38.35,23.62 38.35,21.08 36.83,19.56 36.83,18.92 37.24,18.51 U3.23 ; U1.5 26.63,33.44 v2(26.8,33.27)
  Bottom Layer w0.203: v2(37.21,24.77) 29.34,24.77 27.56,26.54 27.56,32.51 v2(26.8,33.27)
VOUT2: length 16.6
  Top Layer w0.203: v2(41.02,32.89) 40.47,33.44 U2.5 ; v2(41.02,27.94) 41.02,22.37 U3.24
  Bottom Layer w0.203: v2(41.02,27.94) v2(41.02,32.89)
VOUT3: length 32.8
  Top Layer w0.203: 36.58,20.69 37.07,20.69 v2(37.34,20.95) ; v2(53.47,35.18) 55.63,35.18 56.22,34.59 U4.5
  Bottom Layer w0.203: v2(37.34,20.95) 38.86,19.43 45.34,19.43 50.16,24.26 50.16,31.88 v2(53.47,35.18)
VOUT4: length 74.8
  Top Layer w0.203: U5.5 73.11,33.44 v2(73.66,32.89) ; U3.26 35.78,14.57 35.05,13.84 31.12,13.84 30.35,13.08 30.35,10.92 31.5,9.78 39.5,9.78 41.02,11.3 44.32,11.3 46.61,13.59 51.69,13.59 54.48,16.38 54.48,19.36 56.37,21.25 56.37,22.59 56.59,22.81 56.62,22.81 56.67,22.86 59.31,22.86 v2(59.44,22.99)
  Bottom Layer w0.203: v2(73.66,32.89) 73.03,32.26 62.48,32.26 59.44,29.21 v2(59.44,22.99)
$1N497: length 13
  Top Layer w0.203: U3.7 25.78,14.51 X1.2 22.04,10.91 19.26,8.13
$1N523: length 12.2
  Top Layer w0.203: C7.2 25.63,6.06 X1.1 25.63,9.73 U3.8
$1N1166: length 8.9
  Top Layer w0.508: U1.8 18.7,33.78 R3.2
  Top Layer w1.27: R3.2 18.36,36.83 H1.3
$1N2775: length 4.4
  Top Layer w0.508: C12.2 56.96,17.53 U6.4
$1N3268: length 6
  Top Layer w0.203: Q1.3 55.54,18.8 U6.3
$1N3304: length 4.9
  Top Layer w0.203: D3.1 58.97,20.07 U6.2
$1N3412: length 3.4
  Top Layer w0.254: U6.13 C11.1
$1N3449: length 5.4
  Top Layer w0.508: C4.1 43.35,16.11 U3.20
$1N3635: length 8.8
  Top Layer w0.508: U2.8 35.38,33.78 R4.2
  Top Layer w1.27: H2.3 35.06,36.83 R4.2
$1N3989: length 8.8
  Top Layer w0.508: R6.2 68.74,33.78 U5.8
  Top Layer w1.27: R6.2 68.45,36.83 H4.3
$1N3996: length 8.8
  Top Layer w0.508: U4.8 52.06,33.78 R5.2
  Top Layer w1.27: H3.3 51.75,36.83 R5.2

## Copper pours and planes (outline as drawn; the poured copper is in the pictures)
GND on Top Layer: -9.4,49.28 91.69,49.28 91.69,-11.05 -9.4,-11.05
GND on Bottom Layer: -4.44,57.02 98.81,57.02 98.81,-19.43 -4.44,-19.43

## Text on the board
Top Silkscreen Layer: JLCJLCJLC | AbuzzHarbor9999's / ARGB Driver Mk.I
